# Altium schematic sheet JTAG via Connector.SchDoc
size A4; PageSetup: Record=PageOptions|CenterHorizontal=True|CenterVertical=True|PrintScale=0.94|XCorrection=1.00|YCorrection=1.00|PrintKind=1|BorderSize=5000000|LeftOffset=0|BottomOffset=0|Orientation=1|PaperLength=1000|PaperWidth=1000|Scale=100|PaperSource=7|PrintQuality=-4|MediaType=1|DitherType=10|PaperKind=A4|PrintScaleMode=1; DecimalNumber: Децимальный номер; HeadOfSector: Нач. сектора; MainDevice: Перв.примен.; Name: Наименование; Organization: Altium Limited; Address1: L3, 12a Rodborough Rd; Address2: Frenchs Forest; Address3: NSW; Address4: Australia 2086
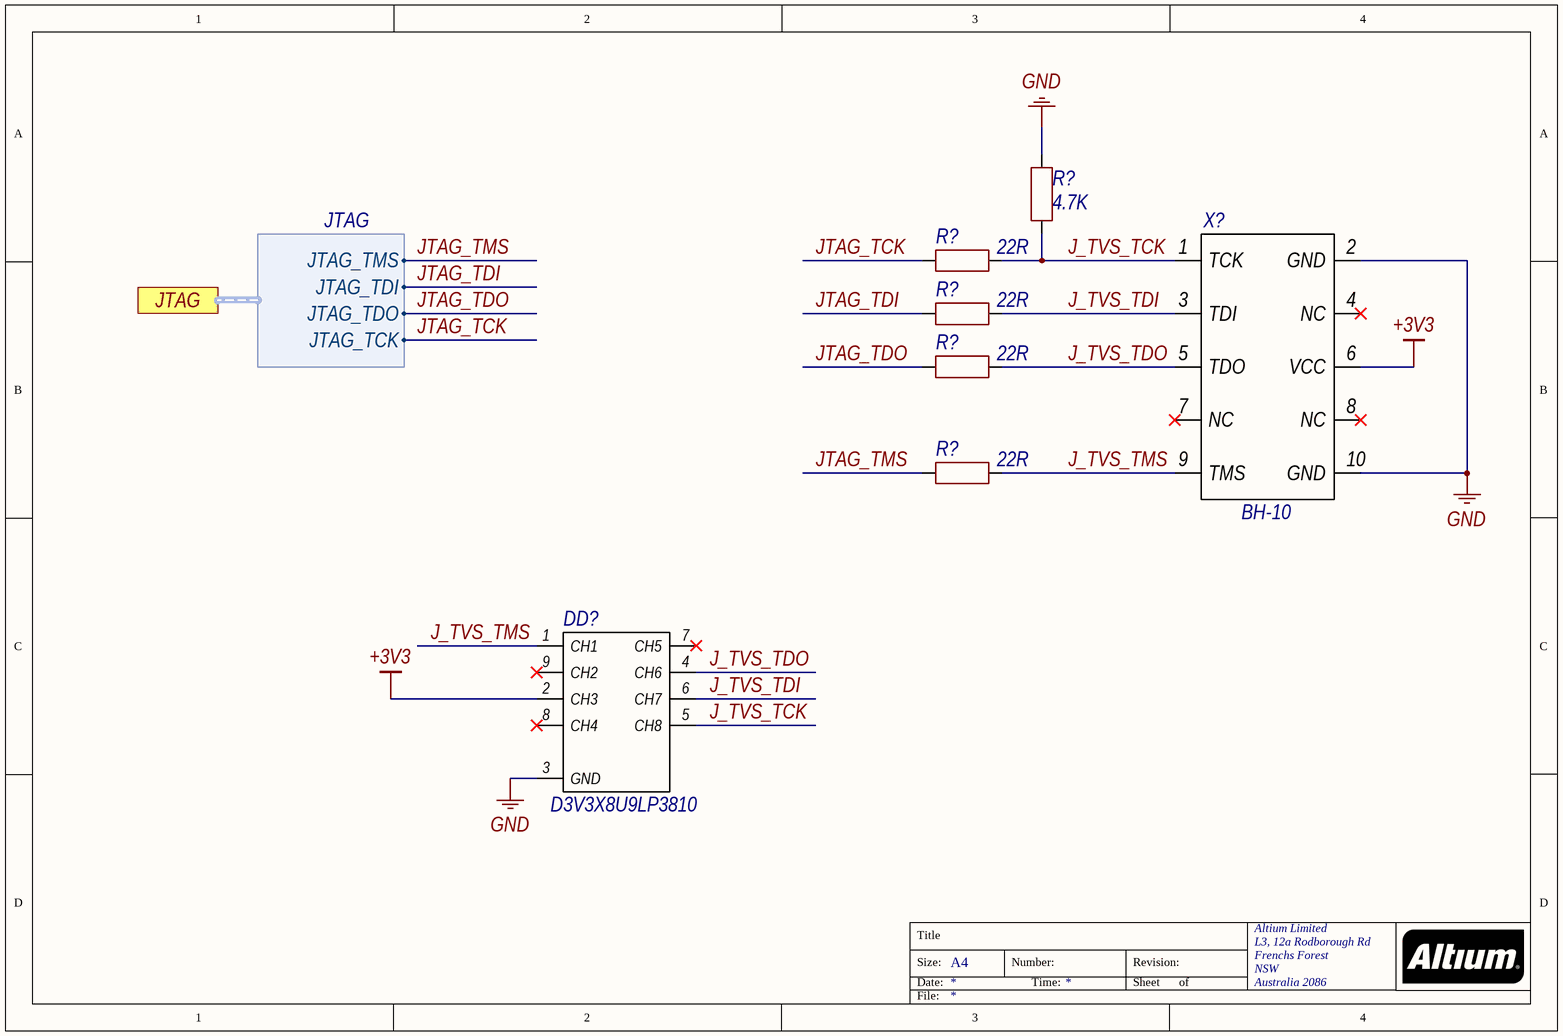
[diagram p0: JTAG via Connector.SchDoc]

## Parts
(Parts that share a designator on the sheet are numbered #1, #2 ... from top to bottom, then left to right.)
DD?  MPN: D3V3X8U9LP3810  [U-DFN3810-9]  (hidden comment: TVS Diode at JTAG)
R?#1  value 4.7K  [RESC0402(1005)_M]  (hidden comment: 4.7K 1/16W)
R?#2  value 22R  [RESC0402(1005)_M]  (hidden comment: 22R 1/16W)
R?#3  value 22R  [RESC0402(1005)_M]  (hidden comment: 22R 1/16W)
R?#4  value 22R  [RESC0402(1005)_M]  (hidden comment: 22R 1/16W)
R?#5  value 22R  [RESC0402(1005)_M]  (hidden comment: 22R 1/16W)
X?  JTAG Socket  [BH-10]  (value not drawn)

## Ports
JTAG (harness JTAG)

## Harnesses
JTAG: JTAG_TMS, JTAG_TDI, JTAG_TDO, JTAG_TCK

## Nets
+3V3: DD?.2(CH3) X?.6(VCC)
GND: DD?.3(GND) R?#1.1 X?.2(GND) X?.10(GND)
J_TVS_TCK: DD?.5(CH8) R?#1.2 R?#2.2 X?.1(TCK)
J_TVS_TDI: DD?.6(CH7) R?#3.2 X?.3(TDI)
J_TVS_TDO: DD?.4(CH6) R?#4.2 X?.5(TDO)
J_TVS_TMS: DD?.1(CH1) R?#5.2 X?.9(TMS)
JTAG_TCK: R?#2.1 ; port JTAG.JTAG_TCK
JTAG_TDI: R?#3.1 ; port JTAG.JTAG_TDI
JTAG_TDO: R?#4.1 ; port JTAG.JTAG_TDO
JTAG_TMS: R?#5.1 ; port JTAG.JTAG_TMS

Not connected (* = marked no-connect by the designer): DD? 7(CH5)* 8(CH4)* 9(CH2)*; X? 4(NC)* 7(NC)* 8(NC)*

## Notes on the sheet
- Title
- Size:
- Date:
- A4
- Number:
- Time:
- Revision:
- Sheet
- of
- File:

## Library data of the parts
DD? = D3V3X8U9LP3810: Manufacturer: DiodesInc; MntType: SMD; Part Number: D3V3X8U9LP3810; MSL: MSL 1; Package: =Footprint; RoHS: Comply; PartType: TVS; Pins: 9; BOMDescription: D3V3X8U9LP3810; CFootprint: =Footprint; ClassName: TVS; ComponentLink1Description: Datasheet; ComponentLink1URL: https://www.diodes.com/assets/Datasheets/D3V3X8U9LP3810.pdf
R?#1 = RES0402: Manufacturer: UNI-ROYAL; ManufacturerAlt: JLCPCB; MPN: 0402WGF4701TCE; MPNAlt: C25900; MntType: SMD; Notes: Basic Part; TempCoeff: 100ppm/C; Tolerance: 1%; Voltage: 50V; Height: 0.35mm; MSL: MSL 1; Package: =Footprint; Power: 1/16W; RoHS: Comply; PartType: CHIP RESISTOR; Pins: 2; BOMDescription: =MntType+' '+PartType+' '+Package+' '+Value+' '+Tolerance+' '+Voltage+' '+TempCoeff+' '+MPN; CFootprint: =Footprint; Part Number: RES0402; ClassName: Resistor; ComponentLink1Description: Datasheet; ComponentLink1Description: New link; ComponentLink1URL: https://datasheet.lcsc.com/lcsc/1810301132_UNI-ROYAL-Uniroyal-Elec-0402WGF4701TCE_C25900.pdf
R?#2-R?#5 = RES0402: Manufacturer: UNI-ROYAL; ManufacturerAlt: JLCPCB; MPN: 0402WGF220JTCE; MPNAlt: C25092; MntType: SMD; Notes: Basic Part; TempCoeff: 200ppm/C; Tolerance: 1%; Voltage: 50V; Height: 0.35mm; MSL: MSL 1; Package: =Footprint; Power: 1/16W; RoHS: Comply; PartType: CHIP RESISTOR; Pins: 2; BOMDescription: =MntType+' '+PartType+' '+Package+' '+Value+' '+Tolerance+' '+Voltage+' '+TempCoeff+' '+MPN; CFootprint: =Footprint; Part Number: RES0402; ClassName: Resistor; ComponentLink1Description: Datasheet; ComponentLink1Description: New link; ComponentLink1URL: https://datasheet.lcsc.com/lcsc/1811011231_UNI-ROYAL-Uniroyal-Elec-0402WGF220JTCE_C25092.pdf
X? = JTAG Socket 10 Pin: MntType: DIP; System: Connector; ComponentLink1Description: Datasheet; MPN: BH-10; Part Number: JTAG Socket 10 Pin; MSL: MSL 1; Package: BH-10; RoHS: Comply; PartType: CONNECTOR; Pins: 10; BOMDescription: =MntType+' '+PartType+' '+Package+' '+Value+' '+Tolerance+' '+Voltage+' '+TempCoeff+' '+MPN; CFootprint: =Footprint; ClassName: Connector; ComponentLink1URL: ***